# Altium schematic sheet Controller.SchDoc
size A; SheetNumber: 1; SheetTotal: 1
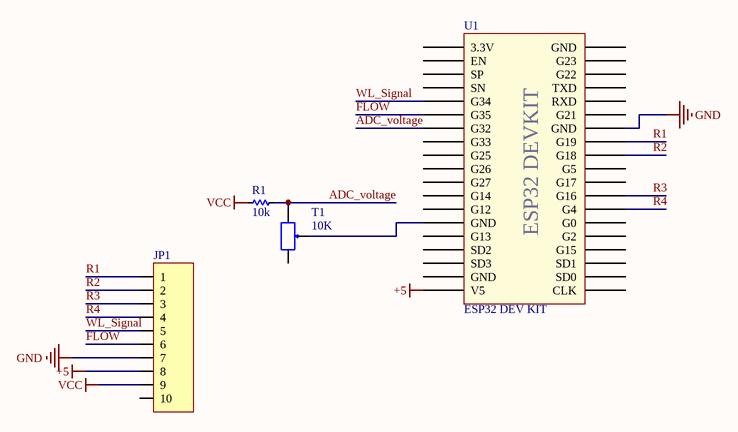
[diagram p0: Controller.SchDoc]

## Parts
JP1  JP 1x10 2.54  [JP 1x10 DC]  (value not drawn)
R1  10k  [RES-1/4W]
T1  10K  [BIEN TRO VI CHINH NAM]
U1  ESP32 DEV KIT  [ESP32 DEVKIT]

## Nets
+5: JP1.8 U1.19(V5)
GND: JP1.7 U1.32(GND)
VCC: JP1.9 R1.2
ADC_voltage: R1.1 T1.1 U1.7(G32)
FLOW: JP1.6 U1.6(G35)
R1: JP1.1 U1.31(G19)
R2: JP1.2 U1.30(G18)
R3: JP1.3 U1.27(G16)
R4: JP1.4 U1.26(G4)
WL_Signal: JP1.5 U1.5(G34)
NetT1_2: T1.2 U1.14(GND)

Not connected (* = marked no-connect by the designer): JP1 10; T1 3; U1 1(3.3V) 2(EN) 3(SP) 4(SN) 8(G33) 9(G25) 10(G26) 11(G27) 12(G14) 13(G12) 15(G13) 16(SD2) 17(SD3) 18(GND) 20(CLK) 21(SD0) 22(SD1) 23(G15) 24(G2) 25(G0) 28(G17) 29(G5) 33(G21) 34(RXD) 35(TXD) 36(G22) 37(G23) 38(GND)

## Notes on the sheet
- (in symbol ESP32 DEV KIT) ESP32 DEVKIT

## Library data of the parts
JP1 = JP 1x10 2.54 Duc Cong: Cắm; Ten_Linh_Kien: Jump Đơn Đực 2.54MM 1x40P Cong Đứng; Don_Vi: Con; Ma_Hang: MH000904; Ghi_Chu: *; Kieu_Chan: *; Chung_Loai: Cắm
R1 = Res: Manufacturer: Generic Components; Class: Passive; SubClass: R; Published: 08/06/2000; Publisher: Altium Hobart Technology Centre
T1 = Bien Tro Tinh Chinh 10K Nam: Cắm; Ma_Hang: MH003232; Ten_Linh_Kien: Biến Trở VR 103-10K 3296W; Don_Vi: Con; Kieu_Chan: *; Chung_Loai: Cắm; Ghi_Chu: *